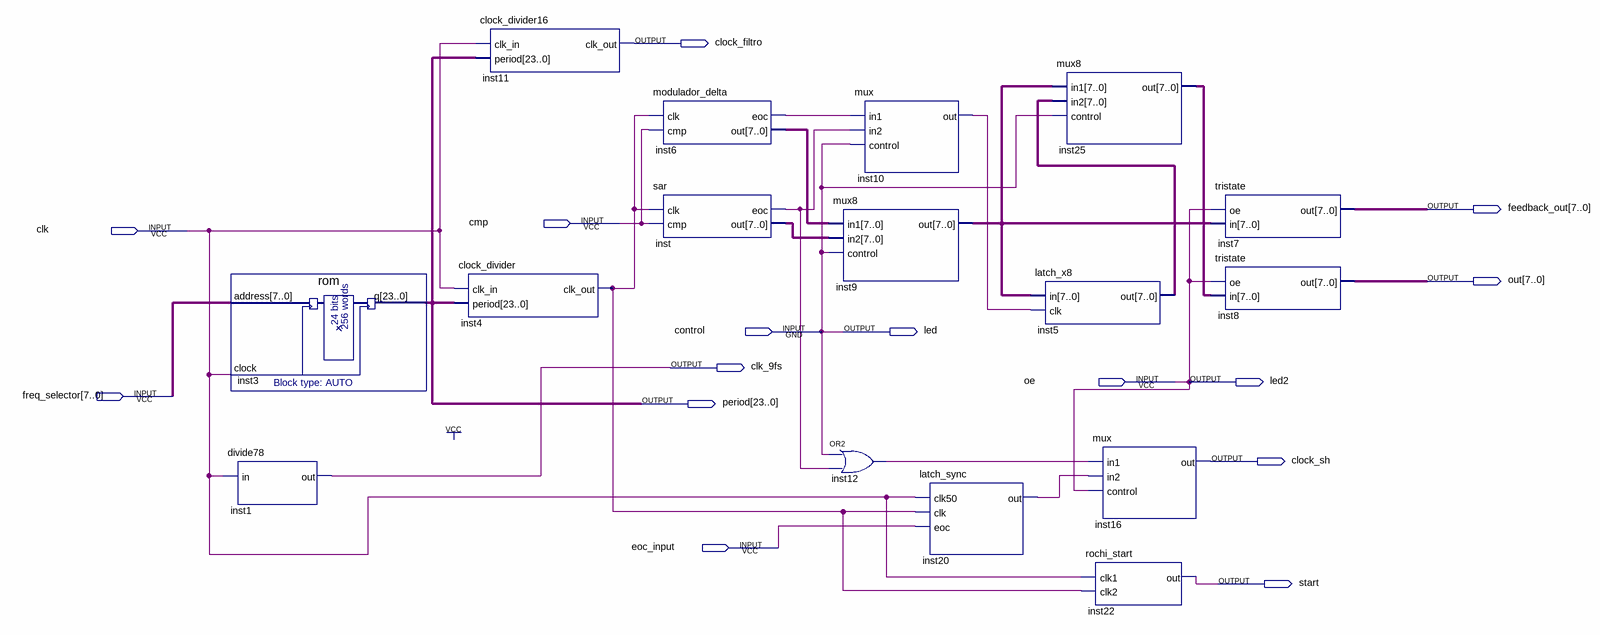
[diagram p0: schematic sheet]
// Quartus schematic main.bdf as structural Verilog: 16 symbols, 15 pins
module main (
  input  cmp,
  input  clk,
  input  control,
  input  oe,
  input  [7:0] freq_selector,
  input  eoc_input,
  output clock_filtro,
  output [7:0] feedback_out,
  output [7:0] out,
  output led,
  output clk_9fs,
  output led2,
  output [23:0] period,
  output clock_sh,
  output start
);

  wire inst4_clk_out, inst6_eoc, inst10_out, inst12_out, inst20_out, inst_eoc;
  wire [7:0] inst5_out, inst6_out, inst9_out, inst25_out, inst_out;

  rom inst3 (.address(freq_selector), .clock(clk), .q(period));
  divide78 inst1 (.in(clk), .out(clk_9fs));
  clock_divider16 inst11 (.clk_in(clk), .period(period), .clk_out(clock_filtro));
  clock_divider inst4 (.clk_in(clk), .period(period), .clk_out(inst4_clk_out));
  modulador_delta inst6 (.clk(inst4_clk_out), .cmp(cmp), .eoc(inst6_eoc), .out(inst6_out));
  sar inst (.clk(inst4_clk_out), .cmp(cmp), .eoc(inst_eoc), .out(inst_out));
  mux8 inst9 (.in1(inst6_out), .in2(inst_out), .control(control), .out(inst9_out));
  or inst12 (inst12_out, control, inst_eoc);
  mux inst10 (.in1(inst6_eoc), .in2(inst_eoc), .control(control), .out(inst10_out));
  latch_sync inst20 (.clk50(clk), .clk(inst4_clk_out), .eoc(eoc_input), .out(inst20_out));
  mux8 inst25 (.in1(inst9_out), .in2(inst5_out), .control(control), .out(inst25_out));
  latch_x8 inst5 (.in(inst9_out), .clk(inst10_out), .out(inst5_out));
  mux inst16 (.in1(inst12_out), .in2(inst20_out), .control(oe), .out(clock_sh));
  rochi_start inst22 (.clk1(clk), .clk2(inst4_clk_out), .out(start));
  tristate inst7 (.oe(oe), .in(inst9_out), .out(feedback_out));
  tristate inst8 (.oe(oe), .in(inst25_out), .out(out));

  assign led = control;
  assign led2 = oe;
endmodule
